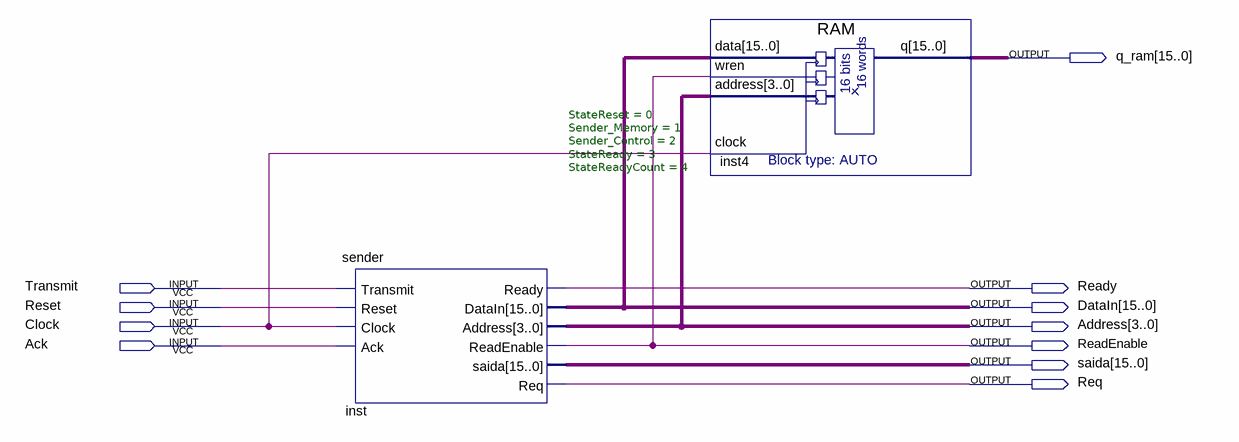
[diagram p0: schematic sheet]
// Quartus schematic module_sender_bdf.bdf as structural Verilog: 2 symbols, 11 pins
module module_sender_bdf (
  input  Transmit,
  input  Reset,
  input  Clock,
  input  Ack,
  output [15:0] q_ram,
  output Ready,
  output [15:0] DataIn,
  output [3:0] Address,
  output ReadEnable,
  output [15:0] saida,
  output Req
);

  sender #(.StateReset(0), .Sender_Memory(1), .Sender_Control(2), .StateReady(3), .StateReadyCount(4)) inst (
    .Transmit(Transmit), .Reset(Reset), .Clock(Clock), .Ack(Ack), .Ready(Ready), .DataIn(DataIn),
    .Address(Address), .ReadEnable(ReadEnable), .saida(saida), .Req(Req));
  RAM inst4 (.data(DataIn), .wren(ReadEnable), .address(Address), .clock(Clock), .q(q_ram));
endmodule
